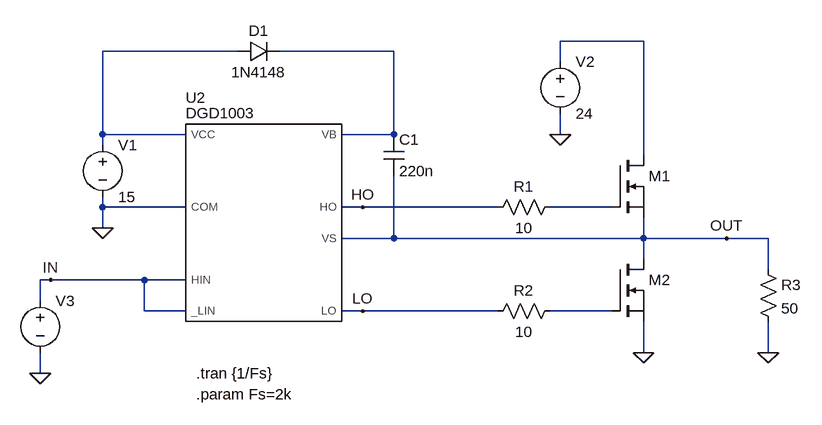
[diagram p0: schematic DGD1003.asc]
DGD1003.asc, the LTspice schematic file:
Version 4.1
SHEET 1 1484 680
WIRE 816 -112 688 -112
WIRE 192 -96 -16 -96
WIRE 432 -96 256 -96
WIRE 688 -80 688 -112
WIRE -16 32 -16 -96
WIRE 112 32 -16 32
WIRE 432 32 432 -96
WIRE 432 32 352 32
WIRE 688 32 688 0
WIRE -16 48 -16 32
WIRE 816 64 816 -112
WIRE -16 144 -16 128
WIRE 112 144 -16 144
WIRE 384 144 352 144
WIRE 592 144 384 144
WIRE 768 144 672 144
WIRE -16 176 -16 144
WIRE 432 192 432 96
WIRE 432 192 352 192
WIRE 816 192 816 160
WIRE 816 192 432 192
WIRE 944 192 816 192
WIRE 1008 192 944 192
WIRE 816 224 816 192
WIRE 1008 240 1008 192
WIRE -96 256 -112 256
WIRE 48 256 -96 256
WIRE 112 256 48 256
WIRE -112 288 -112 256
WIRE 48 304 48 256
WIRE 112 304 48 304
WIRE 384 304 352 304
WIRE 592 304 384 304
WIRE 768 304 672 304
WIRE 816 368 816 320
WIRE 1008 368 1008 320
WIRE -112 400 -112 368
FLAG -112 400 0
FLAG 688 32 0
FLAG 816 368 0
FLAG -16 176 0
FLAG 1008 368 0
FLAG 384 144 HO
FLAG 384 304 LO
FLAG -96 256 IN
FLAG 944 192 OUT
SYMBOL voltage -16 32 R0
WINDOW 123 0 0 Left 0
WINDOW 39 0 0 Left 0
SYMATTR InstName V1
SYMATTR Value 15
SYMBOL voltage -112 272 R0
WINDOW 3 41 64 Invisible 2
WINDOW 123 0 0 Left 0
WINDOW 39 0 0 Left 0
SYMATTR Value PULSE(0 5 {0.25/Fs} 1n 1n {0.5/Fs} {1/Fs})
SYMATTR InstName V3
SYMBOL diode 192 -80 R270
WINDOW 0 32 32 VTop 2
WINDOW 3 0 32 VBottom 2
SYMATTR InstName D1
SYMATTR Value 1N4148
SYMBOL cap 416 32 R0
SYMATTR InstName C1
SYMATTR Value 220n
SYMBOL voltage 688 -96 R0
WINDOW 123 0 0 Left 0
WINDOW 39 0 0 Left 0
SYMATTR InstName V2
SYMATTR Value 24
SYMBOL res 688 128 R90
WINDOW 0 0 56 VBottom 2
WINDOW 3 32 56 VTop 2
SYMATTR InstName R1
SYMATTR Value 10
SYMBOL res 688 288 R90
WINDOW 0 0 56 VBottom 2
WINDOW 3 32 56 VTop 2
SYMATTR InstName R2
SYMATTR Value 10
SYMBOL nmos 768 64 R0
WINDOW 3 56 72 Invisible 2
SYMATTR Value BSB012NE2LX
SYMATTR InstName M1
SYMBOL nmos 768 224 R0
WINDOW 3 56 72 Invisible 2
SYMATTR Value BSB012NE2LX
SYMATTR InstName M2
SYMBOL res 992 224 R0
SYMATTR InstName R3
SYMATTR Value 50
SYMBOL MyLib\\Driver_Gate\\DGD1003 240 224 R0
SYMATTR InstName U2
TEXT 128 400 Left 2 !.tran {1/Fs}
TEXT 128 432 Left 2 !.param Fs=2k

The netlist it stands for:
* DGD1003.asc
V1 N002 0 15
V3 IN 0 PULSE(0 5 {0.25/Fs} 1n 1n {0.5/Fs} {1/Fs})
D1 N002 N003 1N4148
C1 N003 OUT 220n
V2 N001 0 24
R1 N004 HO 10
R2 N005 LO 10
M1 N001 N004 OUT OUT BSB012NE2LX
M2 OUT N005 0 0 BSB012NE2LX
R3 OUT 0 50
X§U2 N002 IN IN 0 LO OUT HO N003 DGD1003  ; pins VCC HIN _LIN COM LO VS HO VB
.model D D
.lib standard.dio
.model NMOS NMOS
.model PMOS PMOS
.lib standard.mos
.tran {1/Fs}
.param Fs=2k
.lib MyLib/Driver_Gate/DGD1003.lib
.backanno
.end